# Altium schematic sheet LMC.SchDoc
size 381 x 241 mm; SheetNumber: 1; SheetTotal: 1
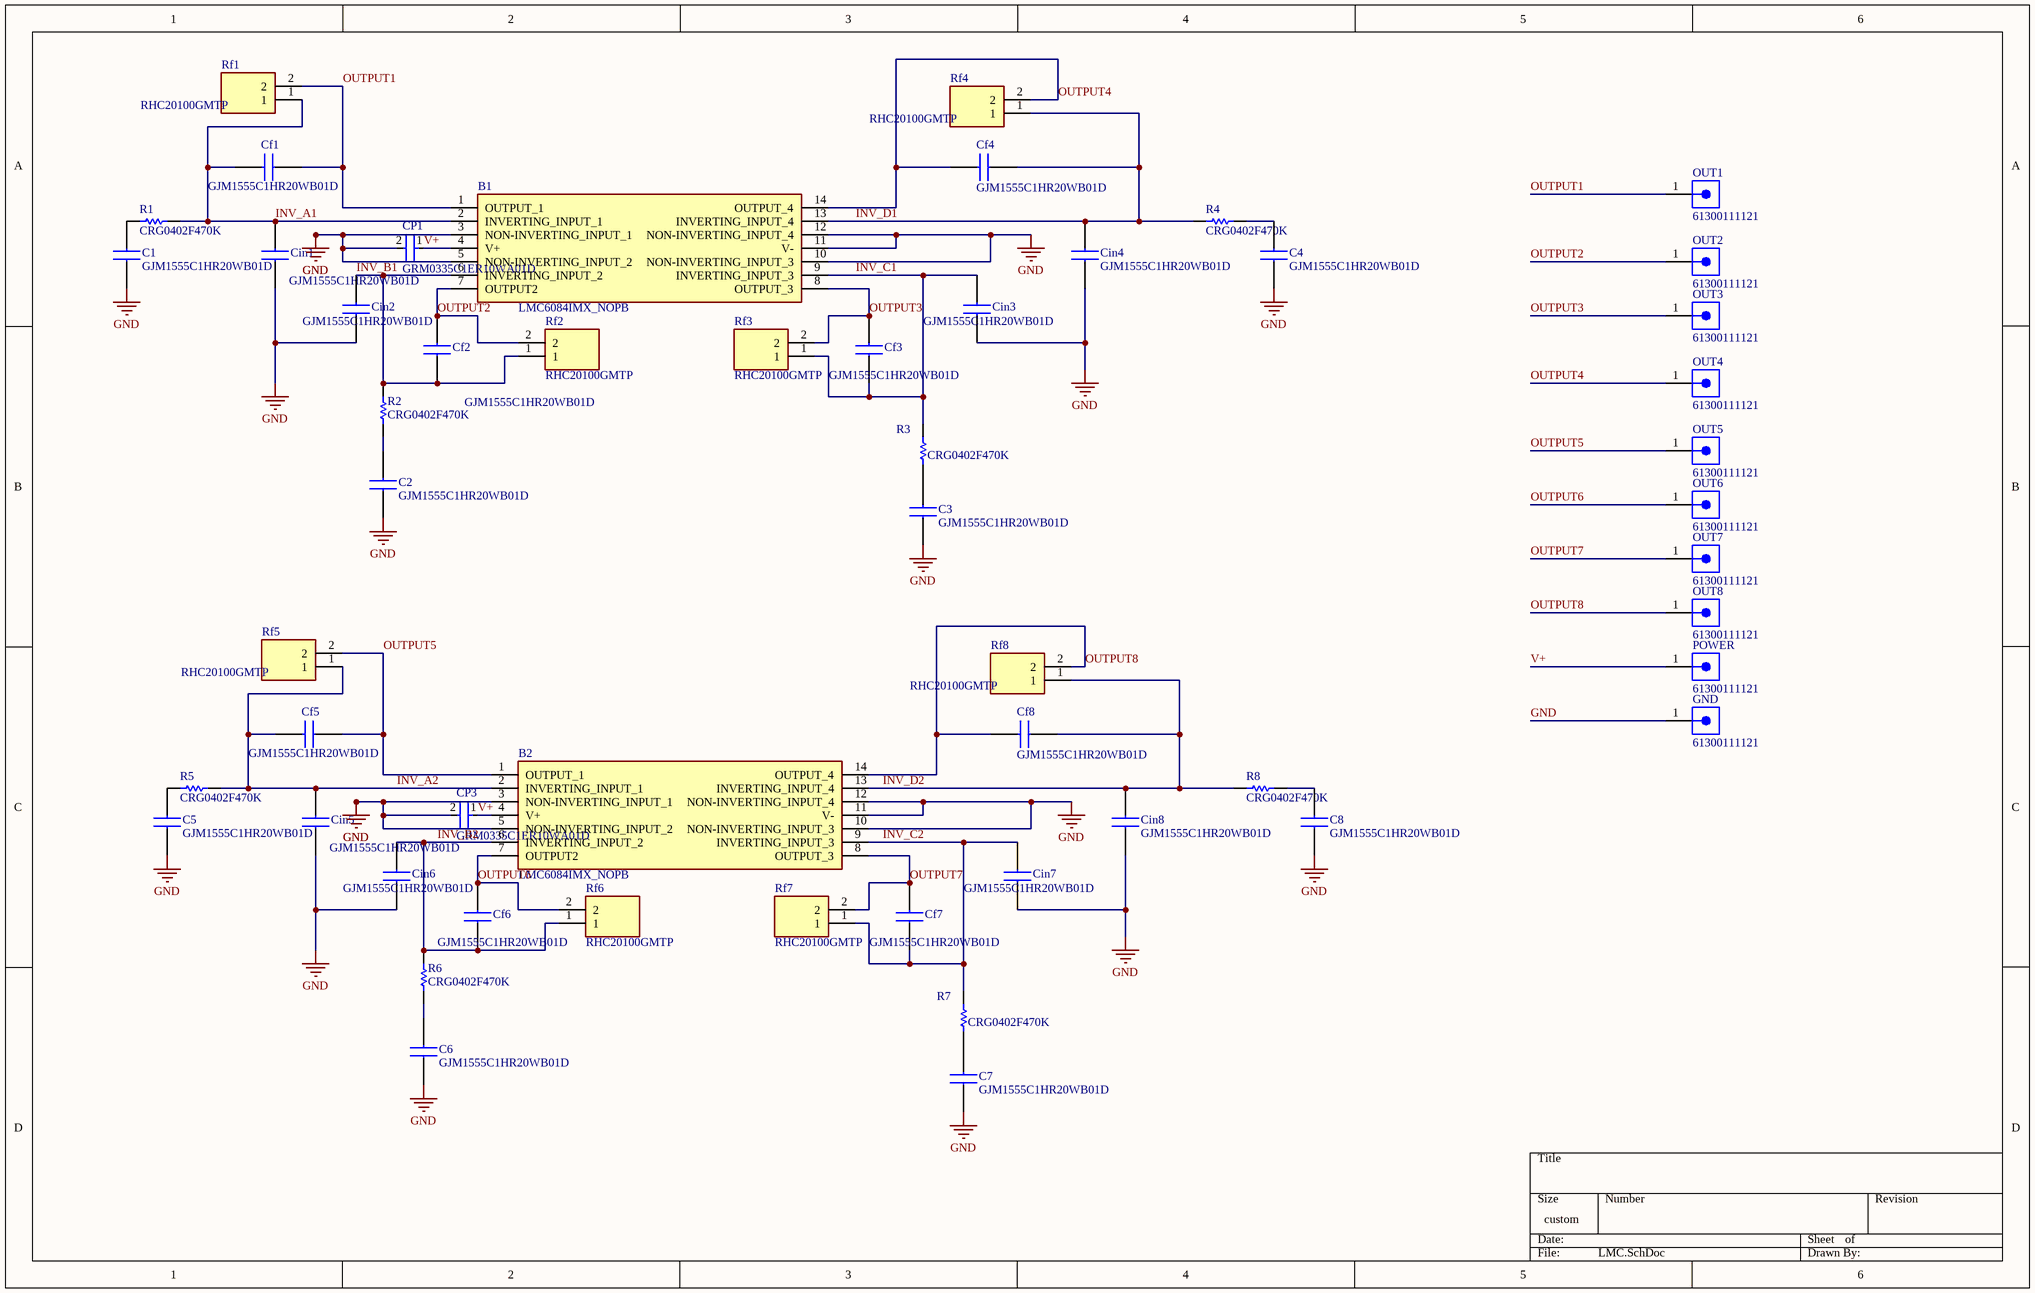
[diagram p0: LMC.SchDoc]

## Parts
B1  LMC6084IMX_NOPB  [SOIC127P600X175-14N]
B2  LMC6084IMX_NOPB  [SOIC127P600X175-14N]
C1  GJM1555C1HR20WB01D  [CAPC1005X55N]
C2  GJM1555C1HR20WB01D  [CAPC1005X55N]
C3  GJM1555C1HR20WB01D  [CAPC1005X55N]
C4  GJM1555C1HR20WB01D  [CAPC1005X55N]
C5  GJM1555C1HR20WB01D  [CAPC1005X55N]
C6  GJM1555C1HR20WB01D  [CAPC1005X55N]
C7  GJM1555C1HR20WB01D  [CAPC1005X55N]
C8  GJM1555C1HR20WB01D  [CAPC1005X55N]
Cf1  GJM1555C1HR20WB01D  [CAPC1005X55N]
Cf2  GJM1555C1HR20WB01D  [CAPC1005X55N]
Cf3  GJM1555C1HR20WB01D  [CAPC1005X55N]
Cf4  GJM1555C1HR20WB01D  [CAPC1005X55N]
Cf5  GJM1555C1HR20WB01D  [CAPC1005X55N]
Cf6  GJM1555C1HR20WB01D  [CAPC1005X55N]
Cf7  GJM1555C1HR20WB01D  [CAPC1005X55N]
Cf8  GJM1555C1HR20WB01D  [CAPC1005X55N]
Cin1  GJM1555C1HR20WB01D  [CAPC1005X55N]
Cin2  GJM1555C1HR20WB01D  [CAPC1005X55N]
Cin3  GJM1555C1HR20WB01D  [CAPC1005X55N]
Cin4  GJM1555C1HR20WB01D  [CAPC1005X55N]
Cin5  GJM1555C1HR20WB01D  [CAPC1005X55N]
Cin6  GJM1555C1HR20WB01D  [CAPC1005X55N]
Cin7  GJM1555C1HR20WB01D  [CAPC1005X55N]
Cin8  GJM1555C1HR20WB01D  [CAPC1005X55N]
CP1  GRM0335C1ER10WA01D  [FP-GRM033-0_03-IPC_A]
CP3  GRM0335C1ER10WA01D  [FP-GRM033-0_03-IPC_A]
GND  61300111121  [61300111121]
OUT1  61300111121  [61300111121]
OUT2  61300111121  [61300111121]
OUT3  61300111121  [61300111121]
OUT4  61300111121  [61300111121]
OUT5  61300111121  [61300111121]
OUT6  61300111121  [61300111121]
OUT7  61300111121  [61300111121]
OUT8  61300111121  [61300111121]
POWER  61300111121  [61300111121]
R1  CRG0402F470K  [RESC1005X40X25LL10T10]
R2  CRG0402F470K  [RESC1005X40X25LL10T10]
R3  CRG0402F470K  [RESC1005X40X25LL10T10]
R4  CRG0402F470K  [RESC1005X40X25LL10T10]
R5  CRG0402F470K  [RESC1005X40X25LL10T10]
R6  CRG0402F470K  [RESC1005X40X25LL10T10]
R7  CRG0402F470K  [RESC1005X40X25LL10T10]
R8  CRG0402F470K  [RESC1005X40X25LL10T10]
Rf1  RHC20100GMTP  [RESC2012X65N]
Rf2  RHC20100GMTP  [RESC2012X65N]
Rf3  RHC20100GMTP  [RESC2012X65N]
Rf4  RHC20100GMTP  [RESC2012X65N]
Rf5  RHC20100GMTP  [RESC2012X65N]
Rf6  RHC20100GMTP  [RESC2012X65N]
Rf7  RHC20100GMTP  [RESC2012X65N]
Rf8  RHC20100GMTP  [RESC2012X65N]

## Nets
GND: B1.3(NON-INVERTING_INPUT_1) B1.5(NON-INVERTING_INPUT_2) B1.10(NON-INVERTING_INPUT_3) B1.11(V-) B1.12(NON-INVERTING_INPUT_4) B2.3(NON-INVERTING_INPUT_1) B2.5(NON-INVERTING_INPUT_2) B2.10(NON-INVERTING_INPUT_3) B2.11(V-) B2.12(NON-INVERTING_INPUT_4) C1.1 C2.1 C3.1 C4.1 C5.1 C6.1 C7.1 C8.1 Cin1.1 Cin2.1 Cin3.1 Cin4.1 Cin5.1 Cin6.1 Cin7.1 Cin8.1 CP1.2 CP3.2 GND.1
INV_A1: B1.2(INVERTING_INPUT_1) Cf1.2 Cin1.2 R1.2 Rf1.1
INV_A2: B2.2(INVERTING_INPUT_1) Cf5.2 Cin5.2 R5.2 Rf5.1
INV_B1: B1.6(INVERTING_INPUT_2) Cf2.2 Cin2.2 R2.2 Rf2.1
INV_B2: B2.6(INVERTING_INPUT_2) Cf6.2 Cin6.2 R6.2 Rf6.1
INV_C1: B1.9(INVERTING_INPUT_3) Cf3.2 Cin3.2 R3.2 Rf3.1
INV_C2: B2.9(INVERTING_INPUT_3) Cf7.2 Cin7.2 R7.2 Rf7.1
INV_D1: B1.13(INVERTING_INPUT_4) Cf4.2 Cin4.2 R4.1 Rf4.1
INV_D2: B2.13(INVERTING_INPUT_4) Cf8.2 Cin8.2 R8.1 Rf8.1
OUTPUT1: B1.1(OUTPUT_1) Cf1.1 OUT1.1 Rf1.2
OUTPUT2: B1.7(OUTPUT2) Cf2.1 OUT2.1 Rf2.2
OUTPUT3: B1.8(OUTPUT_3) Cf3.1 OUT3.1 Rf3.2
OUTPUT4: B1.14(OUTPUT_4) Cf4.1 OUT4.1 Rf4.2
OUTPUT5: B2.1(OUTPUT_1) Cf5.1 OUT5.1 Rf5.2
OUTPUT6: B2.7(OUTPUT2) Cf6.1 OUT6.1 Rf6.2
OUTPUT7: B2.8(OUTPUT_3) Cf7.1 OUT7.1 Rf7.2
OUTPUT8: B2.14(OUTPUT_4) Cf8.1 OUT8.1 Rf8.2
V+: B1.4(V+) B2.4(V+) CP1.1 CP3.1 POWER.1
NetC1_2: C1.2 R1.1
NetC2_2: C2.2 R2.1
NetC3_2: C3.2 R3.1
NetC4_2: C4.2 R4.2
NetC5_2: C5.2 R5.1
NetC6_2: C6.2 R6.1
NetC7_2: C7.2 R7.1
NetC8_2: C8.2 R8.2

## Library data of the parts
B1 B2 = LMC6084IMX_NOPB: Precision CMOS Quad Operational Amplifier; Manufacturer_Name: Texas Instruments; Manufacturer_Part_Number: LMC6084IMX/NOPB; Geometry.Height: 1.75mm; Mouser Part Number: 926-LMC6084IMX/NOPB; Mouser Price/Stock: https://www.mouser.com/Search/Refine.aspx?Keyword=926-LMC6084IMX%2FNOPB; Arrow Part Number: LMC6084IMX/NOPB; Arrow Price/Stock: https://www.arrow.com/en/products/lmc6084imxnopb/texas-instruments; Datasheet Link: http://www.ti.com/lit/gpn/LMC6084
C1-C8 Cf1-Cf8 Cin1-Cin8 = GJM1555C1HR20WB01D: Capacitor GJM15_0.10 L=1.0mm W=0.5mm T=0.5mm; Manufacturer_Name: Murata Electronics; Geometry.Height: 0.55mm; Manufacturer_Part_Number: GJM1555C1HR20WB01D; Mouser Part Number: 81-GJM1555C1HR20WB01; Mouser Price/Stock: https://www.mouser.co.uk/ProductDetail/Murata-Electronics/GJM1555C1HR20WB01D?qs=FE4FjJMnrEJXJfS2X%252B8lsg%3D%3D; Arrow Part Number: GJM1555C1HR20WB01D; Arrow Price/Stock: https://www.arrow.com/en/products/gjm1555c1hr20wb01d/murata-manufacturing?region=nac; Datasheet Link: https://search.murata.co.jp/Ceramy/image/img/A01X/G101/ENG/GJM1555C1HR20WB01-01A.pdf
CP1 CP3 = CMP-2010-01060-2: Chip Multilayer Ceramic Capacitors for General Purpose, 0201, 0.10pF, C0G, 30ppm/°C, 0.05pF, 25V; Capacitance: 0.1pF; Packaging: Tape and Reel; Height: 0.3mm; Case Code (Imperial): 0201; Voltage Rating: 25V; Thickness: 0.013inch; Length: 0.024inch; Termination: SMD/SMT; Case Code (Metric): 0603; Dielectric: C0G; Lead Free: Lead Free; Voltage Rating (DC): 25V; Mount: Surface Mount; Max Operating Temperature: 125°C; Package Quantity: 15000; Min Operating Temperature: -55°C; Case/Package: 0201; Width: 0.012inch
GND OUT1-OUT8 POWER = CMP-1502-01058-4: THT Vertical Pin Header WR-PHD, Pitch 2.54 mm, Single Row, 1 pins; Gender: Male; Contact Resistance: 20mΩ; Current Rating: 3A; Number of Contacts: 1; Connector Type: Male Pin; Operating Supply Voltage: 250V; Termination: Solder; Mount: Through Hole; Orientation: Vertical; Contact Material: Copper; Number of Positions: 1; Color: Black; Packaging: Bulk; Contact Plating: Gold; Number of Pins: 1; Contact Mating Length: 5.9944mm; RoHS: Compliant; Number of Rows: 1; Lead Pitch: 2.54mm
R1-R8 = CMP-2002-05737-1: Manufacturer: TE Connectivity / AMP; Part Number: CRG0402F470K
Rf1-Rf8 = RHC20100GMTP: Thick Film Resistors - SMD 0805 100G 20%; Manufacturer_Name: Kamaya; Geometry.Height: 0.65mm; Manufacturer_Part_Number: RHC20100GMTP; Mouser Part Number: 791-RHC20100GMTP; Mouser Price/Stock: https://www.mouser.co.uk/ProductDetail/Kamaya/RHC20100GMTP?qs=JZJGM%252BYuqVpxyCC7WQOUCw%3D%3D; Arrow Part Number: *; Arrow Price/Stock: *; Datasheet Link: https://eu.mouser.com/datasheet/2/210/kamaya_products_RHC__english_20170203_112609-1842538.pdf